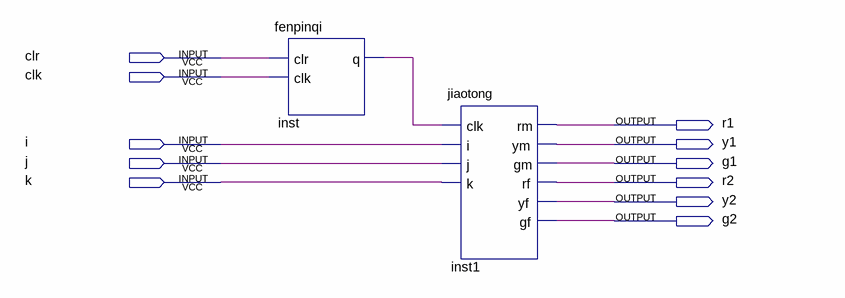
[diagram p0: schematic sheet]
// Quartus schematic zong.bdf as structural Verilog: 2 symbols, 11 pins
module zong (
  input  clr,
  input  clk,
  input  i,
  input  j,
  input  k,
  output r1,
  output y1,
  output g1,
  output r2,
  output y2,
  output g2
);

  wire inst_q;

  fenpinqi inst (.clr(clr), .clk(clk), .q(inst_q));
  jiaotong inst1 (.clk(inst_q), .i(i), .j(j), .k(k), .rm(r1), .ym(y1), .gm(g1), .rf(r2), .yf(y2), .gf(g2));
endmodule
